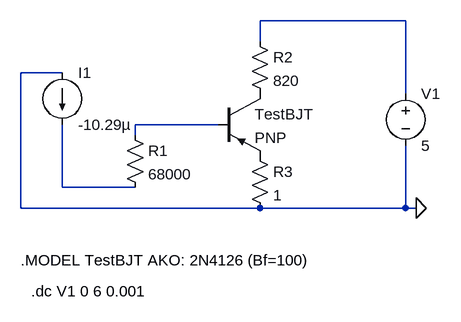
[diagram p0: schematic Draft3.asc]
Draft3.asc, the LTspice schematic file:
Version 4
SHEET 1 880 680
WIRE 512 -48 288 -48
WIRE 288 -16 288 -48
WIRE -16 32 -80 32
WIRE 512 64 512 -48
WIRE 224 112 96 112
WIRE 96 128 96 112
WIRE -16 208 -16 112
WIRE 96 208 -16 208
WIRE -80 240 -80 32
WIRE 288 240 -80 240
WIRE 512 240 512 144
WIRE 512 240 288 240
WIRE 528 240 512 240
FLAG 528 240 0
SYMBOL res 80 112 R0
SYMATTR InstName R1
SYMATTR Value 68000
SYMBOL res 272 -32 R0
SYMATTR InstName R2
SYMATTR Value 820
SYMBOL voltage 512 48 R0
WINDOW 123 0 0 Left 0
WINDOW 39 0 0 Left 0
SYMATTR InstName V1
SYMATTR Value 5
SYMBOL current -16 32 R0
WINDOW 123 0 0 Left 0
WINDOW 39 0 0 Left 0
SYMATTR InstName I1
SYMATTR Value -10.29µ
SYMBOL res 272 144 R0
SYMATTR InstName R3
SYMATTR Value 1
SYMBOL pnp 224 64 R0
SYMATTR InstName TestBJT
TEXT -80 320 Left 2 !.MODEL TestBJT AKO: 2N4126 (Bf=100)
TEXT -64 368 Left 2 !.dc V1 0 6 0.001

The netlist it stands for:
* Draft3.asc
R1 N002 N003 68000
R2 N001 P001 820
V1 N001 0 5
I1 0 N003 -10.29µ
R3 P002 0 1
Q§TestBJT P001 N002 P002 0 PNP
.model NPN NPN
.model PNP PNP
.lib standard.bjt
.MODEL TestBJT AKO: 2N4126 (Bf=100)
.dc V1 0 6 0.001
.backanno
.end